# Altium schematic sheet cpu.SchDoc
size A4
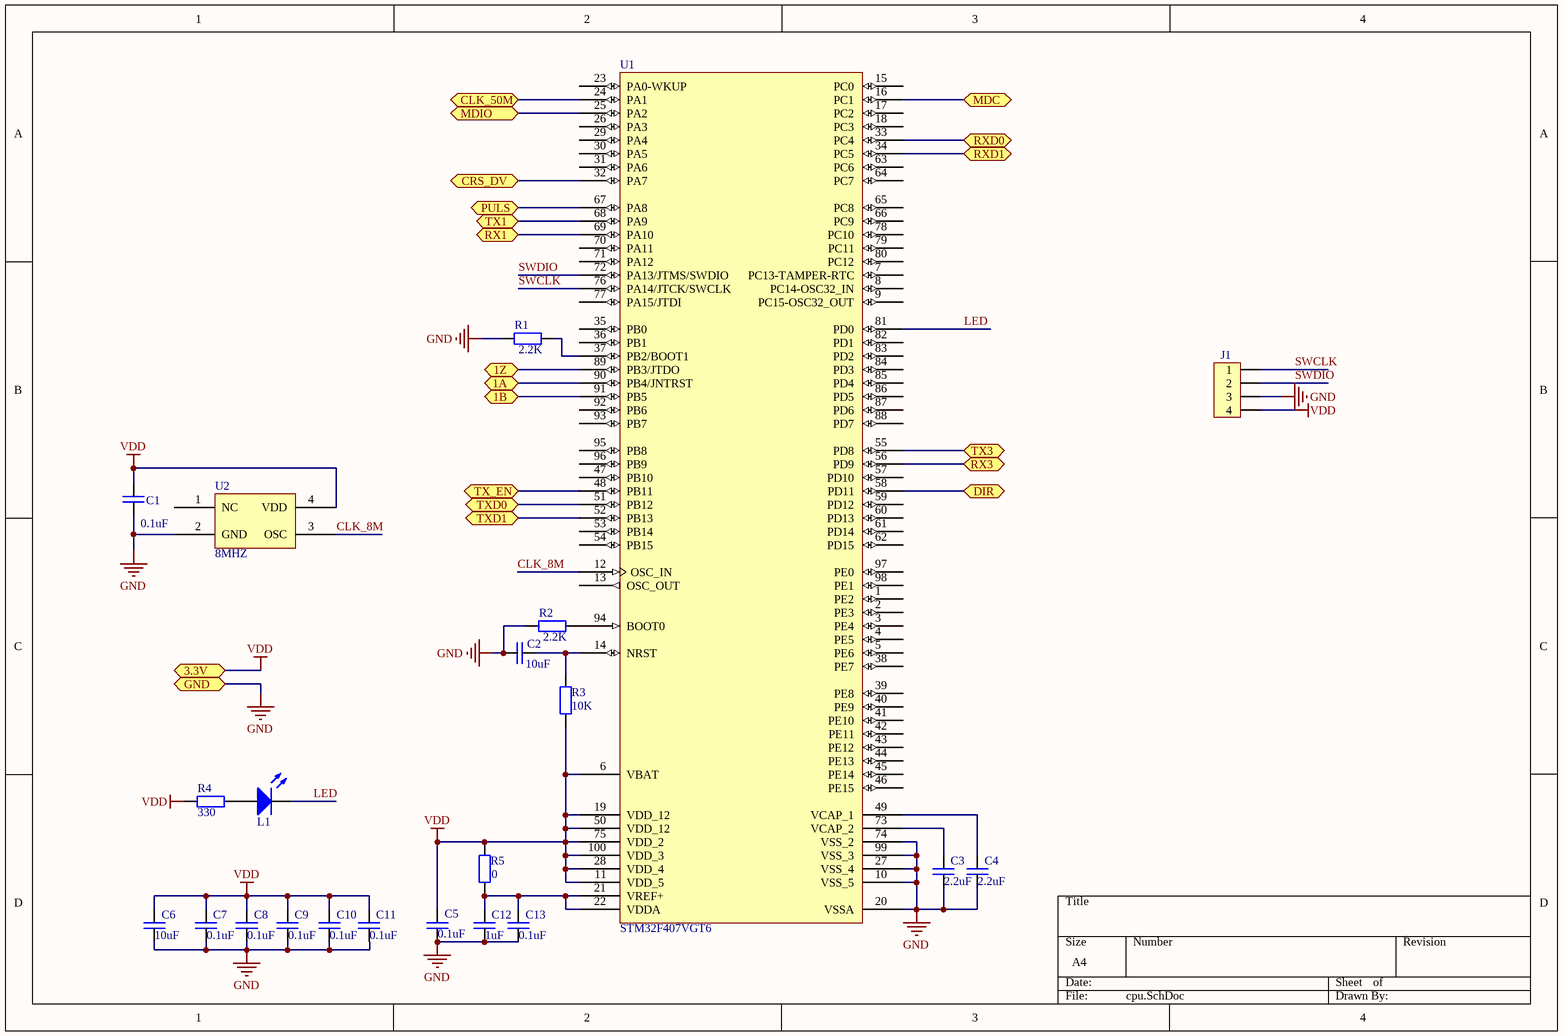
[diagram p0: cpu.SchDoc]

## Parts
C1  value 0.1uF  [CAP-0805]  (hidden comment: CAP)
C2  value 10uF  [CAP-0805]  (hidden comment: CAP)
C3  value 2.2uF  [CAP-0805]  (hidden comment: CAP)
C4  value 2.2uF  [CAP-0805]  (hidden comment: CAP)
C5  value 0.1uF  [CAP-0805]  (hidden comment: CAP)
C6  value 10uF  [CAP-0805]  (hidden comment: CAP)
C7  value 0.1uF  [CAP-0805]  (hidden comment: CAP)
C8  value 0.1uF  [CAP-0805]  (hidden comment: CAP)
C9  value 0.1uF  [CAP-0805]  (hidden comment: CAP)
C10  value 0.1uF  [CAP-0805]  (hidden comment: CAP)
C11  value 0.1uF  [CAP-0805]  (hidden comment: CAP)
C12  value 1uF  [CAP-0805]  (hidden comment: CAP)
C13  value 0.1uF  [CAP-0805]  (hidden comment: CAP)
J1  HDR1*4  [HDR1*4]  (value not drawn)
L1  LED  [LED-0805]  (value not drawn)
R1  value 2.2K  [RES-0805]  (hidden comment: RES)
R2  value 2.2K  [RES-0805]  (hidden comment: RES)
R3  value 10K  [RES-0805]  (hidden comment: RES)
R4  value 330  [RES-0805]  (hidden comment: RES)
R5  value 0  [RES-0805]  (hidden comment: RES)
U1  STM32F407VGT6  [STM32-LQFP100]
U2  8MHZ  [OSC_S]

## Ports
1A, 1B, 1Z, 3.3V, CLK_50M, CRS_DV, DIR, GND, MDC, MDIO, PULS, RX1, RX3, RXD0, RXD1, TX1, TX3, TX_EN, TXD0, TXD1

## Nets
GND: C1.1 C2.1 C3.1 C4.1 C5.1 C6.1 C7.1 C8.1 C9.1 C10.1 C11.1 C12.1 C13.1 J1.3 R1.2 R2.2 U1.10(VSS_5) U1.20(VSSA) U1.27(VSS_4) U1.74(VSS_2) U1.99(VSS_3) U2.2(GND) ; port GND
VDD: C1.2 C5.2 C6.2 C7.2 C8.2 C9.2 C10.2 C11.2 J1.4 R3.2 R4.1 R5.2 U1.6(VBAT) U1.11(VDD_5) U1.19(VDD_12) U1.28(VDD_4) U1.50(VDD_12) U1.75(VDD_2) U1.100(VDD_3) U2.4(VDD) ; port 3.3V
1A: U1.90(PB4/JNTRST) ; port 1A
1B: U1.91(PB5) ; port 1B
1Z: U1.89(PB3/JTDO) ; port 1Z
CLK_8M: U1.12(OSC_IN) U2.3(OSC)
CLK_50M: U1.24(PA1) ; port CLK_50M
CRS_DV: U1.32(PA7) ; port CRS_DV
DIR: U1.58(PD11) ; port DIR
LED: L1.2 U1.81(PD0)
MDC: U1.16(PC1) ; port MDC
MDIO: U1.25(PA2) ; port MDIO
PULS: U1.67(PA8) ; port PULS
RX1: U1.69(PA10) ; port RX1
RX3: U1.56(PD9) ; port RX3
RXD0: U1.33(PC4) ; port RXD0
RXD1: U1.34(PC5) ; port RXD1
SWCLK: J1.1 U1.76(PA14/JTCK/SWCLK)
SWDIO: J1.2 U1.72(PA13/JTMS/SWDIO)
TX1: U1.68(PA9) ; port TX1
TX3: U1.55(PD8) ; port TX3
TX_EN: U1.48(PB11) ; port TX_EN
TXD0: U1.51(PB12) ; port TXD0
TXD1: U1.52(PB13) ; port TXD1
NetC2_2: C2.2 R3.1 U1.14(NRST)
NetC3_2: C3.2 U1.73(VCAP_2)
NetC4_2: C4.2 U1.49(VCAP_1)
NetC12_2: C12.2 C13.2 R5.1 U1.21(VREF+) U1.22(VDDA)
NetL1_1: L1.1 R4.2
NetR1_1: R1.1 U1.37(PB2/BOOT1)
NetR2_1: R2.1 U1.94(BOOT0)

Not connected (* = marked no-connect by the designer): U1 1(PE2) 2(PE3) 3(PE4) 4(PE5) 5(PE6) 7(PC13-TAMPER-RTC) 8(PC14-OSC32_IN) 9(PC15-OSC32_OUT) 13(OSC_OUT) 15(PC0) 17(PC2) 18(PC3) 23(PA0-WKUP) 26(PA3) 29(PA4) 30(PA5) 31(PA6) 35(PB0) 36(PB1) 38(PE7) 39(PE8) 40(PE9) 41(PE10) 42(PE11) 43(PE12) 44(PE13) 45(PE14) 46(PE15) 47(PB10) 53(PB14) 54(PB15) 57(PD10) 59(PD12) 60(PD13) 61(PD14) 62(PD15) 63(PC6) 64(PC7) 65(PC8) 66(PC9) 70(PA11) 71(PA12) 77(PA15/JTDI) 78(PC10) 79(PC11) 80(PC12) 82(PD1) 83(PD2) 84(PD3) 85(PD4) 86(PD5) 87(PD6) 88(PD7) 92(PB6) 93(PB7) 95(PB8) 96(PB9) 97(PE0) 98(PE1); U2 1(NC)

## Library data of the parts
U2 = OSC